# EAGLE schematic Gamma-BOTTOM (EAGLE 9.5.2)
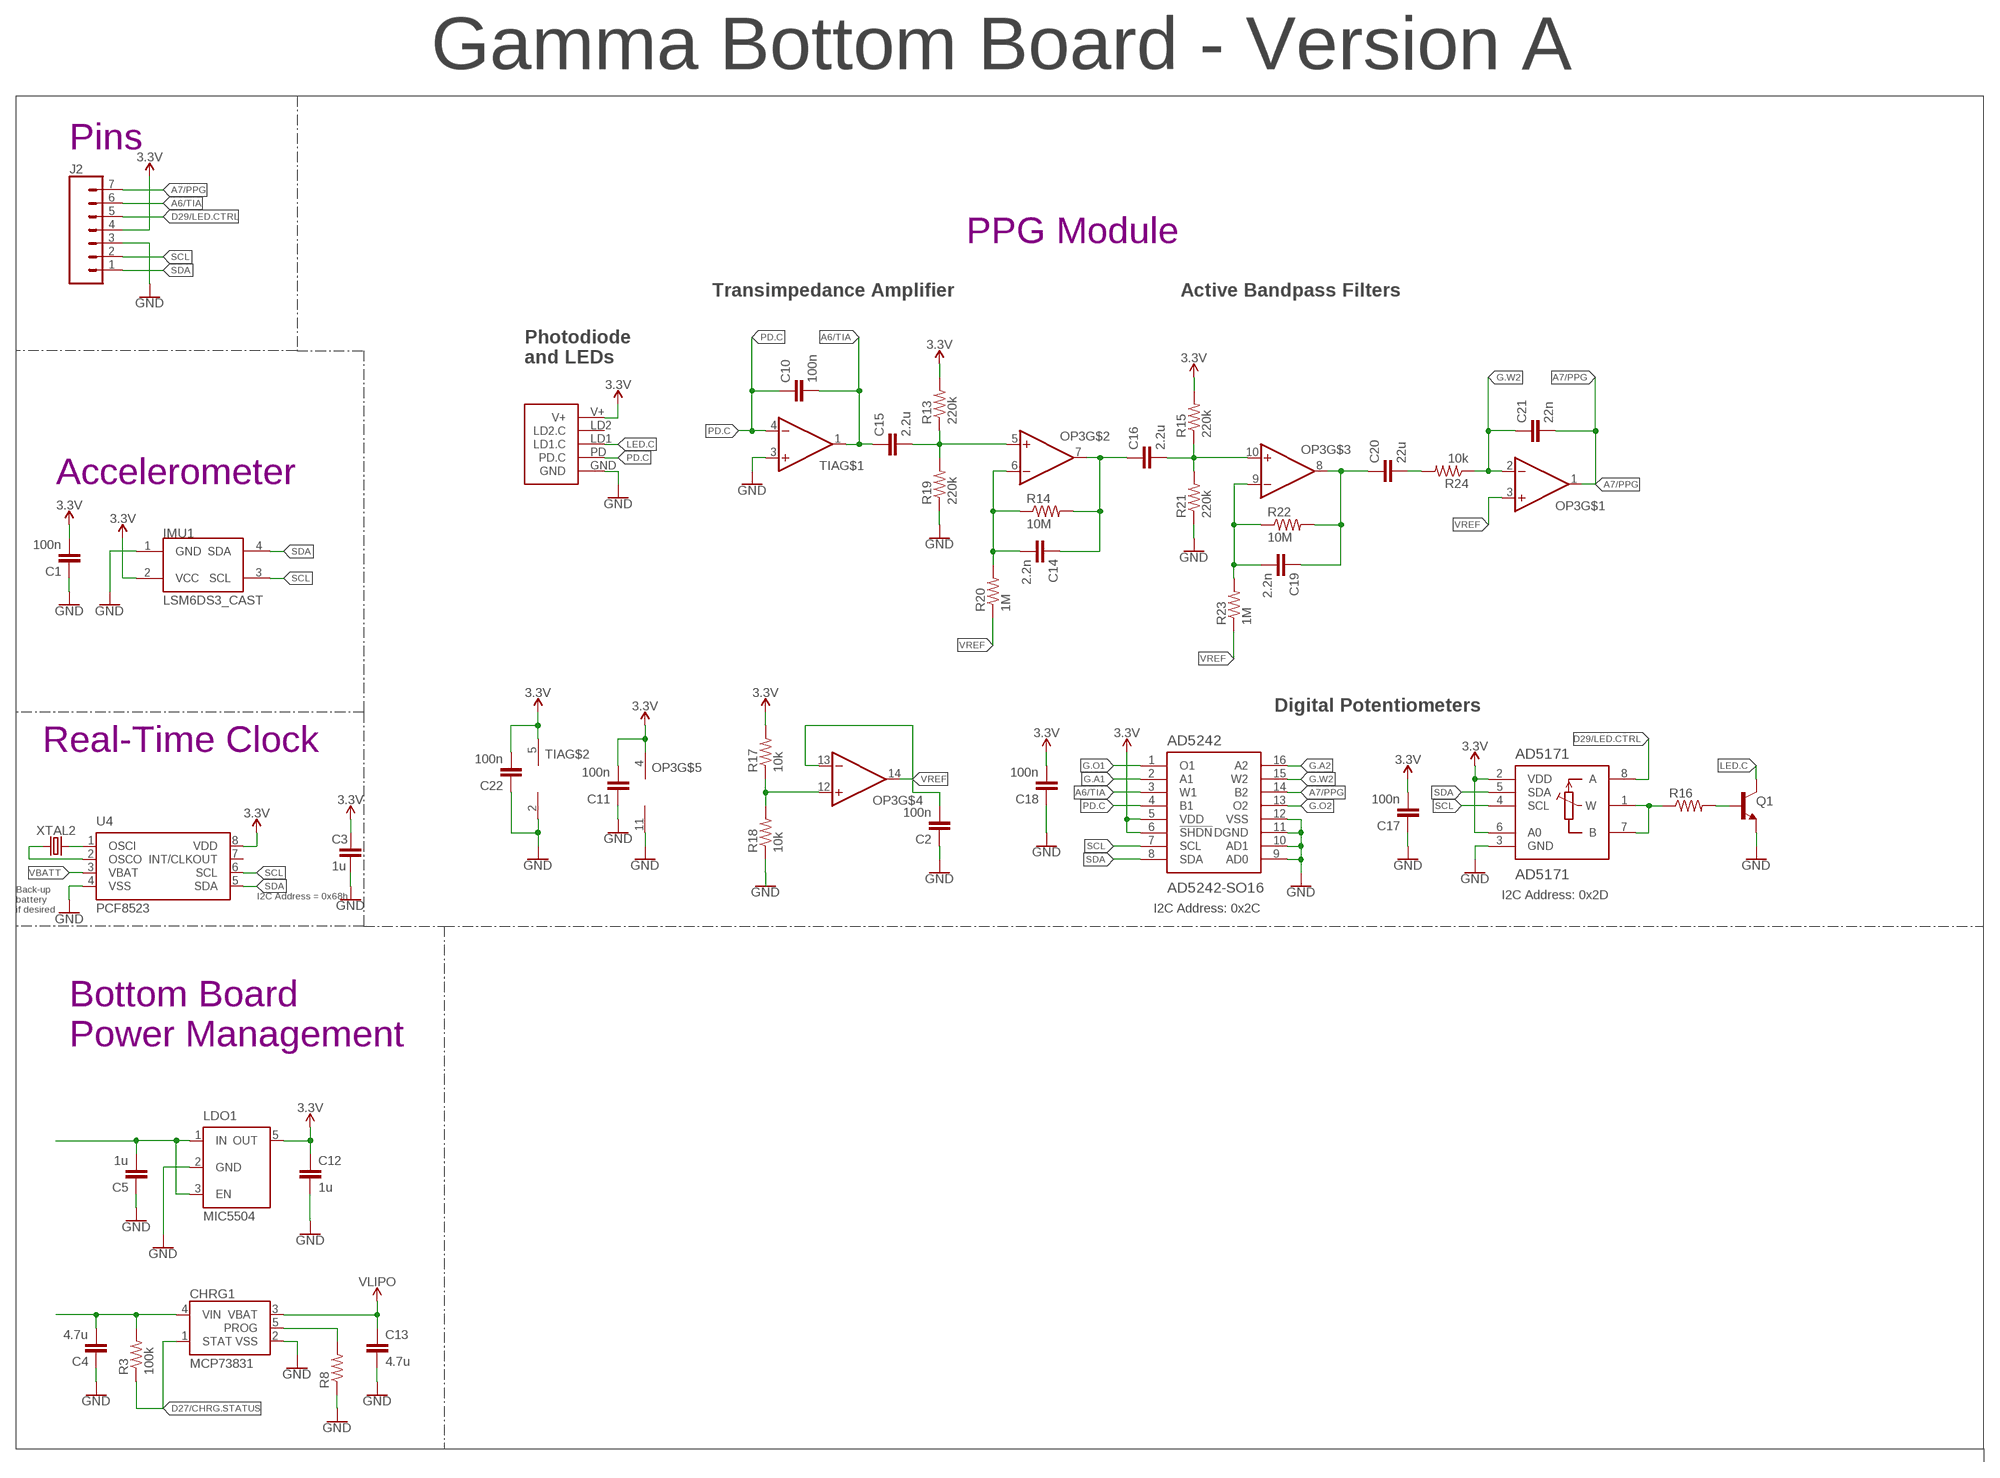
[diagram p0: schematic, sheet 1]

## Parts
AD5171  AD5171  [SOT-23-8]
AD5242  AD5242-SO16  [SO16]
C1  100n  CAPACITOR0603  [C0603]
C2  100n  CAPACITOR0603  [C0603]
C3  1u  CAPACITOR0603  [C0603]
C4  4.7u  CAPACITOR0603  [C0603]
C5  1u  CAPACITOR0603  [C0603]
C10  100n  CAPACITOR0603  [C0603]
C11  100n  CAPACITOR0603  [C0603]
C12  1u  CAPACITOR0603  [C0603]
C13  4.7u  CAPACITOR0603  [C0603]
C14  2.2n  CAPACITOR0603  [C0603]
C15  2.2u  CAPACITOR0603  [C0603]
C16  2.2u  CAPACITOR0603  [C0603]
C17  100n  CAPACITOR0603  [C0603]
C18  100n  CAPACITOR0603  [C0603]
C19  2.2n  CAPACITOR0603  [C0603]
C20  22u  CAPACITOR0603  [C0603]
C21  22n  CAPACITOR0603  [C0603]
C22  100n  CAPACITOR0603  [C0603]
CHRG1  MCP73831  [SOT23-5]
IMU1  LSM6DS3_CAST  [LSM6DS3_CAST]
J2  CONN_07-1.27MM  [1X07_1.27MM]
LDO1  MIC5504  [SOT23-5]
OP3  OP-QUAD-SO14  [SO14]
Q1  NPN-GENERIC  [SOT23-3]
R3  100k  RESISTOR0603  [R0603]
R8  RESISTOR0603  [R0603]
R13  220k  RESISTOR0603  [R0603]
R14  10M  RESISTOR0603  [R0603]
R15  220k  RESISTOR0603  [R0603]
R16  RESISTOR0603  [R0603]
R17  10k  RESISTOR0402  [R0402]
R18  10k  RESISTOR0402  [R0402]
R19  220k  RESISTOR0603  [R0603]
R20  1M  RESISTOR0603  [R0603]
R21  220k  RESISTOR0603  [R0603]
R22  10M  RESISTOR0603  [R0603]
R23  1M  RESISTOR0603  [R0603]
R24  10k  RESISTOR0603  [R0603]
TIA  OP-SINGLEOT  [SOT23-5]
U4  PCF8523  [SO8]
U$3  PPG.MODULE.2  [PPG.MODULE.2]
XTAL2  32.7680kHz  CRYSTALECS-.327-12.5-12-C-TR  [2-SMD.NOLEAD.2.0MMTO1.2MM]

## Nets
3.3V: AD5171.2(VDD) AD5171.6(A0) AD5242.5(VDD) AD5242.6(!SHDN) C1.2 C3.1 C11.2 C12.1 C17.2 C18.2 C22.2 IMU1.2(VCC) J2.4 LDO1.5(OUT) OP3.4(V+) R13.2 R15.2 R17.2 TIA.5(V+) U4.8(VDD) U$3.V+
A6/TIA: AD5242.3(W1) C10.2 C15.1 J2.6 TIA.1(OUT)
A7/PPG: AD5242.14(B2) C21.2 J2.7 OP3.1(OUT)
D27/CHRG.STATUS: CHRG1.1(STAT) R3.1
D29/LED.CTRL: AD5171.8(A) J2.5
G.A1: AD5242.2(A1)
G.A2: AD5242.16(A2)
G.O1: AD5242.1(O1)
G.O2: AD5242.13(O2)
G.W2: AD5242.15(W2) C21.1 OP3.2(-IN) R24.1
GND: AD5171.3(GND) AD5242.9(AD0) AD5242.10(AD1) AD5242.11(DGND) AD5242.12(VSS) C1.1 C2.1 C3.2 C4.1 C5.1 C11.1 C12.2 C13.2 C17.1 C18.1 C22.1 CHRG1.2(VSS) IMU1.1(GND) J2.3 LDO1.2(GND) OP3.11(V-) Q1.2(E) R8.1 R18.1 R19.1 R21.1 TIA.2(V-) TIA.3(+IN) U4.4(VSS) U$3.GND
LED.C: Q1.3(C) U$3.LD1(LD1.C)
N$1: U4.2(OSCO) XTAL2.P$1
N$2: U4.1(OSCI) XTAL2.P$2
N$3: CHRG1.5(PROG) R8.2
N$8: Q1.1(B) R16.2
N$9: AD5171.1(W) AD5171.7(B) R16.1
N$10: OP3.12(+IN) R17.1 R18.2
N$13: C15.2 OP3.5(+IN) R13.1 R19.2
N$15: C14.2 OP3.6(-IN) R14.1 R20.2
N$16: C14.1 C16.1 OP3.7(OUT) R14.2
N$17: C16.2 OP3.10(+IN) R15.1 R21.2
N$18: C19.2 OP3.9(-IN) R22.1 R23.2
N$19: C19.1 C20.1 OP3.8(OUT) R22.2
N$20: C20.2 R24.2
PD.C: AD5242.4(B1) C10.1 TIA.4(-IN) U$3.PD(PD.C)
SCL: AD5171.4(SCL) AD5242.7(SCL) IMU1.3(SCL) J2.2 U4.6(SCL)
SDA: AD5171.5(SDA) AD5242.8(SDA) IMU1.4(SDA) J2.1 U4.5(SDA)
VBATT: U4.3(VBAT)
VIN1: C4.2 C5.2 CHRG1.4(VIN) LDO1.1(IN) LDO1.3(EN) R3.2
VLIPO: C13.1 CHRG1.3(VBAT)
VREF: C2.2 OP3.3(+IN) OP3.13(-IN) OP3.14(OUT) R20.1 R23.1
Unconnected: U4.7(INT/CLKOUT) U$3.LD2(LD2.C)

## Notes on the sheet
- Gamma Bottom Board - Version A
- Pins
- PPG Module
- Transimpedance Amplifier | Active Bandpass Filters
- Photodiode
  and LEDs
- Accelerometer
- Digital Potentiometers
- Real-Time Clock
- I2C Address = 0x68h | I2C Address: 0x2D
- Back-up
  battery
  if desired
- I2C Address: 0x2C
- Bottom Board
  Power Management

## Library data of the parts
AD5171 = LinnesLab-DigitalIC:AD5171
AD5242 = LinnesLab-DigitalIC:AD5242
C1-C5 C10-C22 = LinnesLab-Passives:CAPACITOR
CHRG1 = LinnesLab-Power:MCP73831: MCP73831T Li-Ion, Li-Pol Controller Miniature single cell, fully integrated Li-Ion, Li-polymer charge management controller Datasheet <http://ww1.microchip.com/downloads/en/DeviceDoc/20001984g.pdf> SparkFun Products: SparkFun ESP32 Thing <https://www.sparkfun.com/products/13907> SparkFun 9DoF Razor IMU M0 <https://www.sparkfun.com/products/14001>; PROD_ID: IC-09995
IMU1 = LinnesLab-Sensors:LSM6DS3_CAST
J2 = LinnesLab-Connectors:CONN_07: Multi connection point. Often used as Generic Header-pin footprint for 0.1 inch spaced/style header connections On any of the 0.1 inch spaced packages, you can populate with these: Break Away Headers - Straight <https://www.sparkfun.com/products/116> (PRT-00116) Break Away Male Headers - Right Angle <https://www.sparkfun.com/products/553> (PRT-00553) Female Headers <https://www.sparkfun.com/products/115> (PRT-00115) Break Away Headers - Machine Pin <https://www.sparkfun.com/products/117> (PRT-00117) Break Away Female Headers - Swiss Machine Pin <https://www.sparkfun.com/products/743> (PRT-00743) For SCREWTERMINALS and SPRING TERMINALS visit here: Screw Terimnals on SparkFun.com <https://www.sparkfun.com/search/results?term=Screw+Terminals> (5mm/3.5mm/2.54mm spacing) This device is also useful as a general connection point to wire up your design to another part of your project. Our various solder wires solder well into these plated through hole pads. Hook-Up Wire - Assortment (Stranded, 22 AWG) <https://www.sparkfun.com/products/11375> (PRT-11375) Hook-Up Wire - Assortment (Solid Core, 22 AWG) <https://www.sparkfun.com/products/11367> (PRT-11367) View the entire wire category on our website here <https://www.sparkfun.com/categories/141> Special notes: Molex polarized connector foot print use with SKU : PRT-08231 with associated crimp pins and housings. 1MM SMD Version SKU: PRT-10208 NOTES ON THE VARIANTS LOCK and LOCK_LONGPADS... This footprint was designed to help hold the alignment of a through-hole component (i.e. 6-pin header) while soldering it into place. You may notice that each hole has been shifted either up or down by 0.005 of an inch from it's more standard position (which is a perfectly straight line). This slight alteration caused the pins (the squares in the middle) to touch the edges of the holes. Because they are alternating, it causes a "brace" to hold the component in place. 0.005 has proven to be the perfect amount of "off-center" position when using our standard breakaway headers. Although looks a little odd when you look at the bare footprint, once you have a header in there, the alteration is very hard to notice. Also,if you push a header all the way into place, it is covered up entirely on the bottom side.
LDO1 = LinnesLab-Power:MIC5504: MIC5504 Voltage Regulator Output Voltages: 1.0V to 3.3V Input Voltages: 2.5V to 5.5V Link to Datasheet http://ww1.microchip.com/downloads/en/DeviceDoc/MIC550X.pdf
OP3 = LinnesLab-AnalogIC:OP-QUAD: General symbol and footprints for Quad Op Amps. Use with any standard general purpose op amp.
Q1 = LinnesLab-DiscreteSemi:NPN
R3 R8 R13-R24 = LinnesLab-Passives:RESISTOR
TIA = LinnesLab-AnalogIC:OP-SINGLE: Single Op Amp 2.7V to 6.0V Single Supply CMOS Source: http://ww1.microchip.com/downloads/en/DeviceDoc/21314g.pdf
U4 = LinnesLab-Clocks:PCF8523; DIGIKEY: 568-5306-1-ND; I2C_ADDRESS: 0x68h; MFN: PCF8523T/1,118; MFN_MANUFACTURER: NXP USA Inc.
U$3 = LinnesLab-Connectors:PPG.MODULE.2: Digi-Key Part Number: S9014E-50-ND Manufacturer Part Number: GRPB501VWVN-RC Description: 1mm insulation height 0.05in pitch 50 positions
XTAL2 = LinnesLab-Clocks:CRYSTAL; DIGIKEY: XC2288CT-ND; FREQ: 32.7680KHZ; LOAD_CAP: 12.5pF